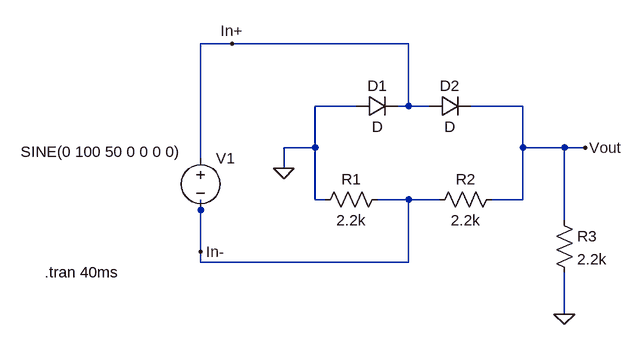
[diagram p0: schematic full-wave rectifier circuit.asc]
full-wave rectifier circuit.asc, the LTspice schematic file:
Version 4.1
SHEET 1 880 680
WIRE 64 -48 16 -48
WIRE 336 -48 64 -48
WIRE 256 48 192 48
WIRE 336 48 336 -48
WIRE 336 48 320 48
WIRE 368 48 336 48
WIRE 512 48 432 48
WIRE 192 112 192 48
WIRE 192 112 144 112
WIRE 512 112 512 48
WIRE 576 112 512 112
WIRE 608 112 576 112
WIRE 16 128 16 -48
WIRE 144 144 144 112
WIRE 192 192 192 112
WIRE 208 192 192 192
WIRE 336 192 288 192
WIRE 384 192 336 192
WIRE 512 192 512 112
WIRE 512 192 464 192
WIRE 16 208 16 192
WIRE 576 224 576 112
WIRE 16 272 16 208
WIRE 16 288 16 272
WIRE 336 288 336 192
WIRE 336 288 16 288
WIRE 576 368 576 304
FLAG 576 368 0
FLAG 144 144 0
FLAG 16 272 In-
FLAG 64 -48 In+
FLAG 608 112 Vout
SYMBOL voltage 16 112 R0
WINDOW 3 -277 6 Left 2
WINDOW 123 0 0 Left 0
WINDOW 39 0 0 Left 0
SYMATTR InstName V1
SYMATTR Value SINE(0 100 50 0 0 0 0)
SYMBOL res 304 176 R90
WINDOW 0 0 56 VBottom 2
WINDOW 3 32 56 VTop 2
SYMATTR InstName R1
SYMATTR Value 2.2k
SYMBOL res 480 176 R90
WINDOW 0 0 56 VBottom 2
WINDOW 3 32 56 VTop 2
SYMATTR InstName R2
SYMATTR Value 2.2k
SYMBOL res 560 208 R0
SYMATTR InstName R3
SYMATTR Value 2.2k
SYMBOL diode 368 64 R270
WINDOW 0 32 32 VTop 2
WINDOW 3 0 32 VBottom 2
SYMATTR InstName D2
SYMBOL diode 256 64 R270
WINDOW 0 32 32 VTop 2
WINDOW 3 0 32 VBottom 2
SYMATTR InstName D1
TEXT -224 304 Left 2 !.tran 40ms

The netlist it stands for:
* full-wave rectifier circuit.asc
V1 In+ In- SINE(0 100 50 0 0 0 0)
R1 In- 0 2.2k
R2 Vout In- 2.2k
R3 Vout 0 2.2k
D2 In+ Vout D
D1 0 In+ D
.model D D
.lib standard.dio
.tran 40ms
.backanno
.end